# Altium project CCZynq.PrjPCB (part 3 of 4)

## Sheet Power.SchDoc
size 431 x 279 mm
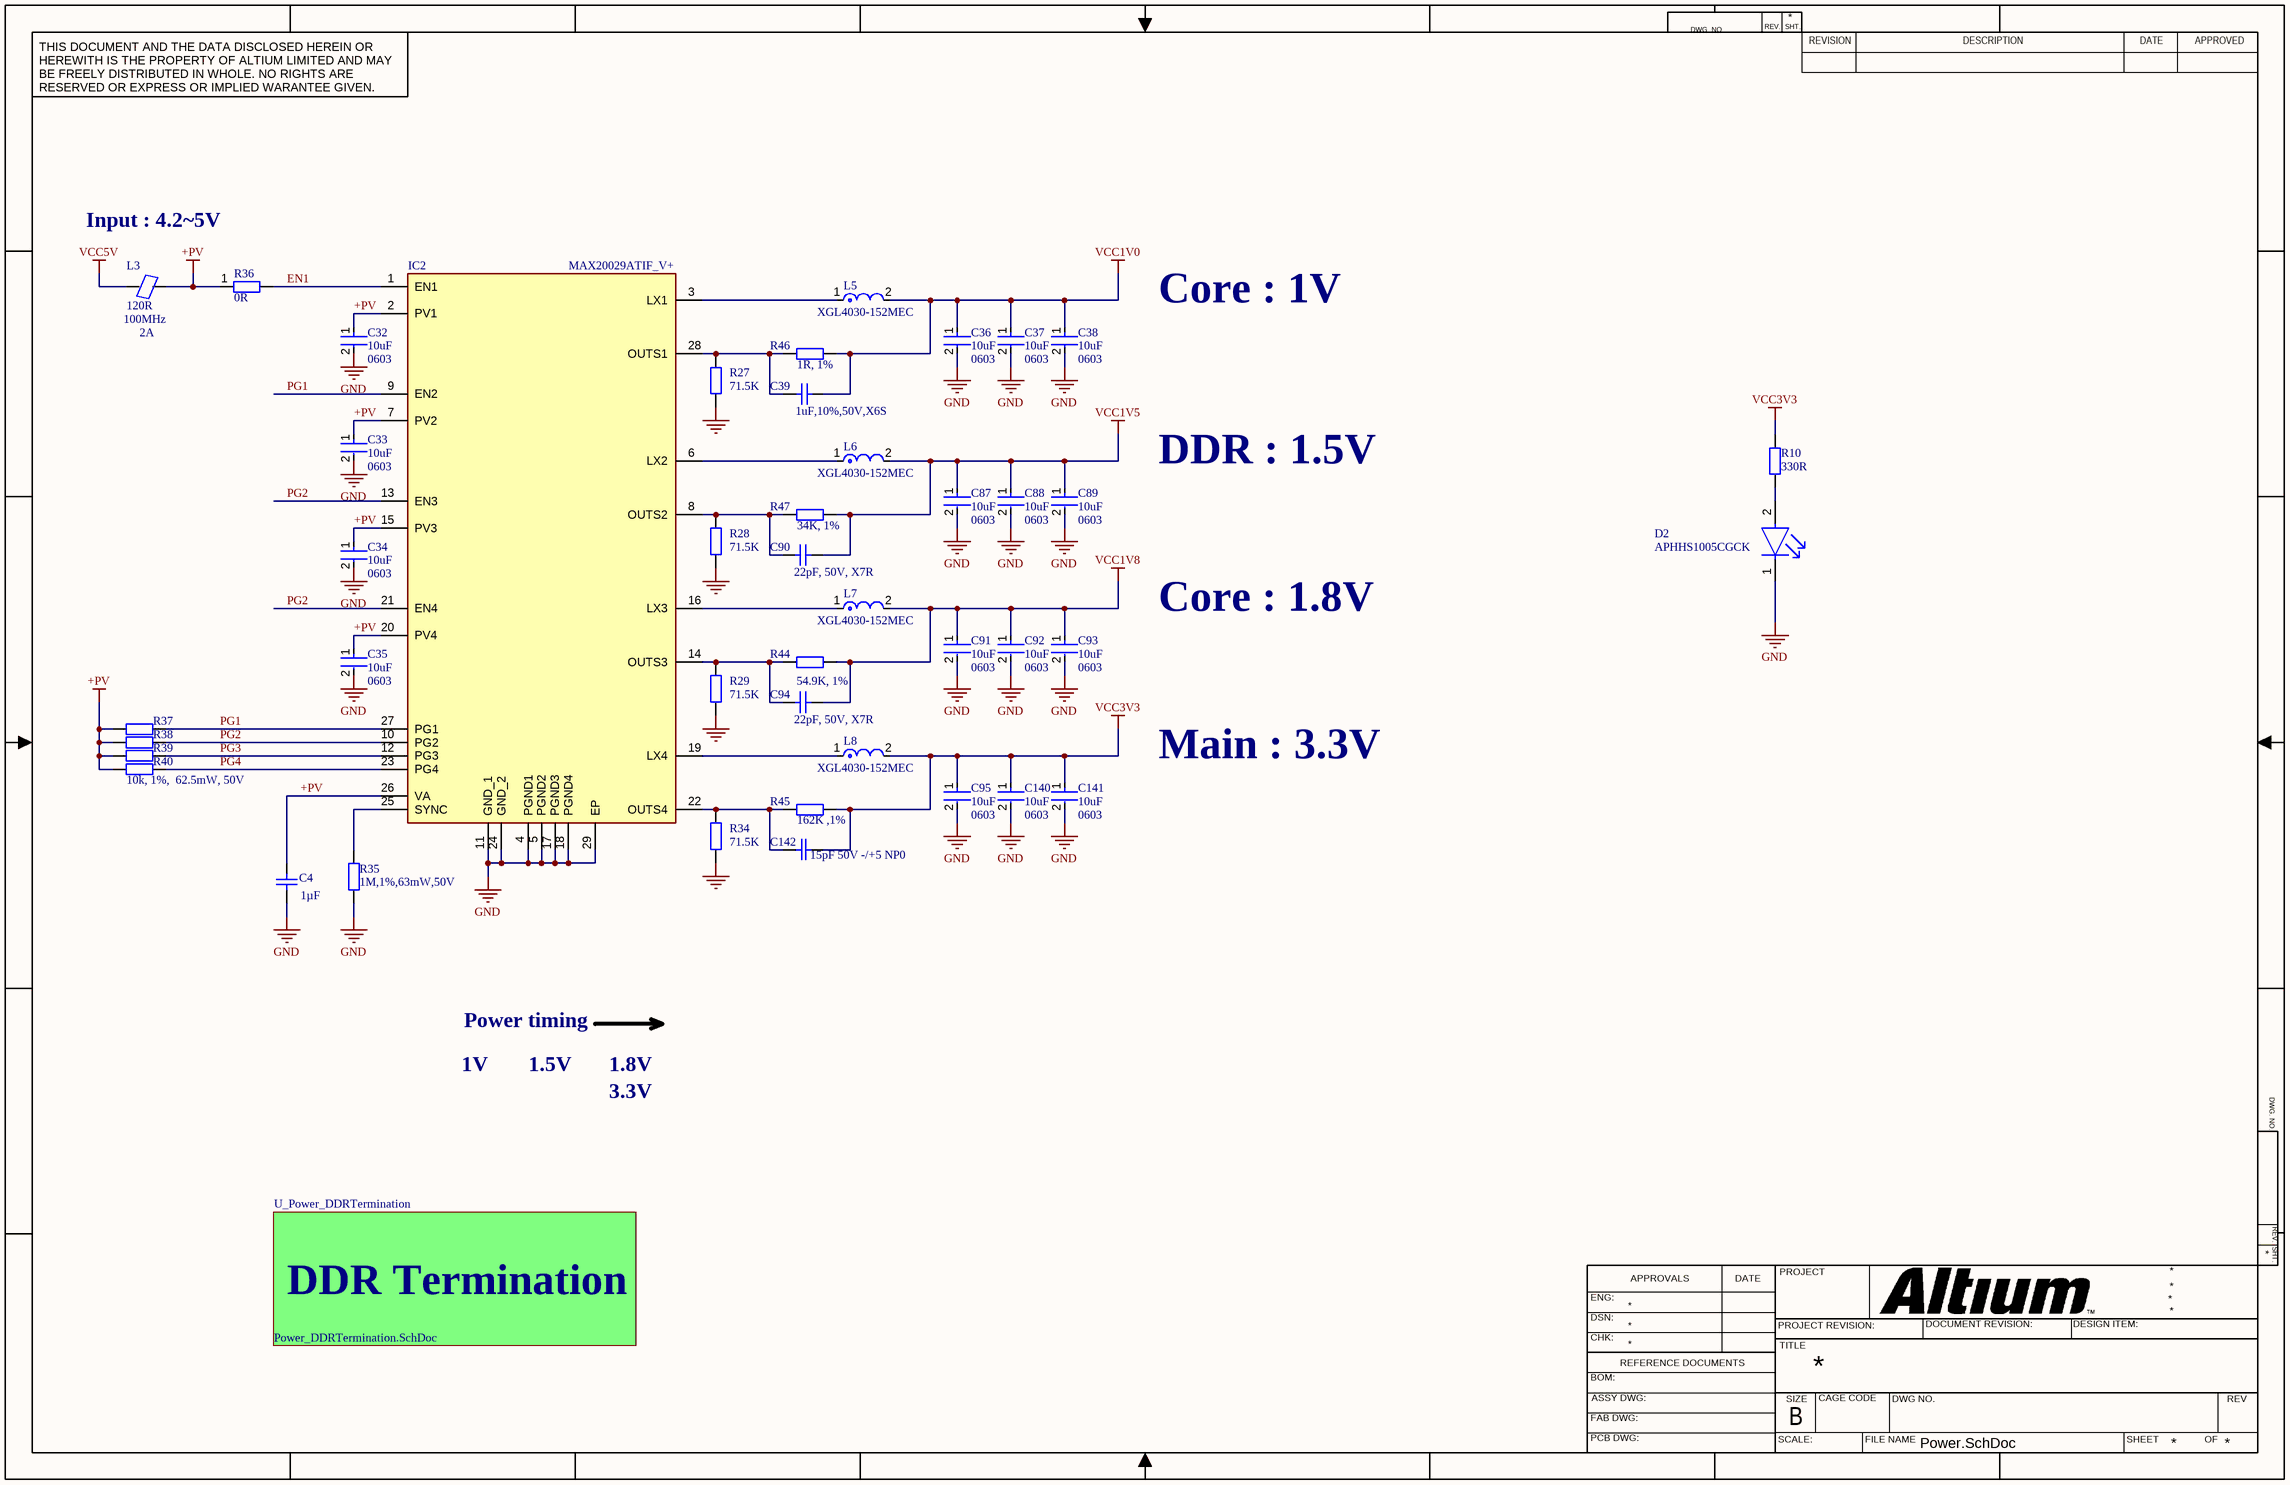
[diagram p6: Power.SchDoc]

### Parts
C4  1µF  [CAP0402i]
C32  Capacitance: 10uF  Case/Package: 0603  [FP-GRM188-0_1-e0_2_0_55-IPC_A]  (hidden comment: GRM188R60J106ME47D)
C33  Capacitance: 10uF  Case/Package: 0603  [FP-GRM188-0_1-e0_2_0_55-IPC_A]  (hidden comment: GRM188R60J106ME47D)
C34  Capacitance: 10uF  Case/Package: 0603  [FP-GRM188-0_1-e0_2_0_55-IPC_A]  (hidden comment: GRM188R60J106ME47D)
C35  Capacitance: 10uF  Case/Package: 0603  [FP-GRM188-0_1-e0_2_0_55-IPC_A]  (hidden comment: GRM188R60J106ME47D)
C36  Capacitance: 10uF  Case/Package: 0603  [FP-GRM188-0_1-e0_2_0_55-IPC_A]  (hidden comment: GRM188R60J106ME47D)
C37  Capacitance: 10uF  Case/Package: 0603  [FP-GRM188-0_1-e0_2_0_55-IPC_A]  (hidden comment: GRM188R60J106ME47D)
C38  Capacitance: 10uF  Case/Package: 0603  [FP-GRM188-0_1-e0_2_0_55-IPC_A]  (hidden comment: GRM188R60J106ME47D)
C39  value 1uF,10%,50V,X6S  [CAP0402i]  (hidden comment: 1µF)
C87  Capacitance: 10uF  Case/Package: 0603  [FP-GRM188-0_1-e0_2_0_55-IPC_A]  (hidden comment: GRM188R60J106ME47D)
C88  Capacitance: 10uF  Case/Package: 0603  [FP-GRM188-0_1-e0_2_0_55-IPC_A]  (hidden comment: GRM188R60J106ME47D)
C89  Capacitance: 10uF  Case/Package: 0603  [FP-GRM188-0_1-e0_2_0_55-IPC_A]  (hidden comment: GRM188R60J106ME47D)
C90  value 22pF, 50V, X7R  [cap0402i]  (hidden comment: 22pF)
C91  Capacitance: 10uF  Case/Package: 0603  [FP-GRM188-0_1-e0_2_0_55-IPC_A]  (hidden comment: GRM188R60J106ME47D)
C92  Capacitance: 10uF  Case/Package: 0603  [FP-GRM188-0_1-e0_2_0_55-IPC_A]  (hidden comment: GRM188R60J106ME47D)
C93  Capacitance: 10uF  Case/Package: 0603  [FP-GRM188-0_1-e0_2_0_55-IPC_A]  (hidden comment: GRM188R60J106ME47D)
C94  value 22pF, 50V, X7R  [cap0402i]  (hidden comment: 22pF)
C95  Capacitance: 10uF  Case/Package: 0603  [FP-GRM188-0_1-e0_2_0_55-IPC_A]  (hidden comment: GRM188R60J106ME47D)
C140  Capacitance: 10uF  Case/Package: 0603  [FP-GRM188-0_1-e0_2_0_55-IPC_A]  (hidden comment: GRM188R60J106ME47D)
C141  Capacitance: 10uF  Case/Package: 0603  [FP-GRM188-0_1-e0_2_0_55-IPC_A]  (hidden comment: GRM188R60J106ME47D)
C142  value 15pF 50V -/+5 NP0  [CAP0402i]  (hidden comment: 15pF)
D2  APHHS1005CGCK  [FP-APHHS1005CGCK-MFG]
IC2  MAX20029ATIF_V+  [QFN50P500X500X80-29N]
L3  Impedance: 120R  Max DC Current: 2A  Test Frequency: 100MHz  [CAP0402i]  (hidden comment: FB_120@100MHz)
L5  XGL4030-152MEC  [FP-XGL4030-MFG]
L6  XGL4030-152MEC  [FP-XGL4030-MFG]
L7  XGL4030-152MEC  [FP-XGL4030-MFG]
L8  XGL4030-152MEC  [FP-XGL4030-MFG]
R10  330R  [RES0402i]
R27  71.5K  [RES0402i]
R28  71.5K  [RES0402i]
R29  71.5K  [RES0402i]
R34  71.5K  [RES0402i]
R35  value 1M,1%,63mW,50V  [RES0402i]  (hidden comment: 1MOhm)
R36  value 0R  [RES0402i]  (hidden comment: 0 Ohms)
R37  10 kOhms  [RES0402i]  (value not drawn)
R38  10 kOhms  [RES0402i]  (value not drawn)
R39  10 kOhms  [RES0402i]  (value not drawn)
R40  value 10k, 1%,  62.5mW, 50V  [RES0402i]  (hidden comment: 10 kOhms)
R44  value 54.9K, 1%  [RES0402i]  (hidden comment: 54.9K)
R45  value 162K ,1%  [RES0402i]  (hidden comment: 162K)
R46  value 1R, 1%  [RES0402i]  (hidden comment: 1R)
R47  value 34K, 1%  [RES0402i]  (hidden comment: 34K)

### Sub-sheets
U_Power_DDRTermination = Power_DDRTermination.SchDoc: no entries

### Nets
+PV: C4.2 C32.1 C33.1 C34.1 C35.1 IC2.2(PV1) IC2.7(PV2) IC2.15(PV3) IC2.20(PV4) IC2.26(VA) L3.2 R36.1 R37.1 R38.1 R39.1 R40.1
GND: C4.1 C32.2 C33.2 C34.2 C35.2 C36.2 C37.2 C38.2 C87.2 C88.2 C89.2 C91.2 C92.2 C93.2 C95.2 C140.2 C141.2 D2.1(C) IC2.4(PGND1) IC2.5(PGND2) IC2.11(GND_1) IC2.17(PGND3) IC2.18(PGND4) IC2.24(GND_2) IC2.29(EP) R27.1 R28.1 R29.1 R34.1 R35.1
VCC1V0: C36.1 C37.1 C38.1 C39.2 L5.2 R46.2
VCC1V5: C87.1 C88.1 C89.1 C90.2 L6.2 R47.2
VCC1V8: C91.1 C92.1 C93.1 C94.2 L7.2 R44.2
VCC3V3: C95.1 C140.1 C141.1 C142.1 L8.2 R10.2 R45.2
VCC5V: L3.1
EN1: IC2.1(EN1) R36.2
PG1: IC2.9(EN2) IC2.27(PG1) R37.2
PG2: IC2.10(PG2) IC2.13(EN3) IC2.21(EN4) R38.2
PG3: IC2.12(PG3) R39.2
PG4: IC2.23(PG4) R40.2
NetC39_1: C39.1 IC2.28(OUTS1) R27.2 R46.1
NetC90_1: C90.1 IC2.8(OUTS2) R28.2 R47.1
NetC94_1: C94.1 IC2.14(OUTS3) R29.2 R44.1
NetC142_2: C142.2 IC2.22(OUTS4) R34.2 R45.1
NetD2_2: D2.2(A) R10.1
NetIC2_3: IC2.3(LX1) L5.1
NetIC2_6: IC2.6(LX2) L6.1
NetIC2_16: IC2.16(LX3) L7.1
NetIC2_19: IC2.19(LX4) L8.1
NetIC2_25: IC2.25(SYNC) R35.2

### Notes on the sheet
- Input : 4.2~5V
- Core : 1V
- DDR : 1.5V
- Core : 1.8V
- Main : 3.3V
- Power timing
- 1V
- 1.5V
- 1.8V
- 3.3V
- DDR Termination
- DWG. NO.
- REV.
- SHT.
- THIS DOCUMENT AND THE DATA DISCLOSED HEREIN OR HEREWITH IS THE PROPERTY OF ALTIUM LIMITED AND MAY BE FREELY DISTRIBUTED IN WHOLE. NO RIGHTS ARE RESERVED OR EXPRESS OR IMPLIED WARANTEE GIVEN.
- REVISION
- DESCRIPTION
- DATE
- APPROVED
- ENG:
- APPROVALS
- PROJECT
- DSN:
- CHK:
- REFERENCE DOCUMENTS
- PROJECT REVISION:
- TITLE
- DOCUMENT REVISION:
- DESIGN ITEM:
- BOM:
- FAB DWG:
- PCB DWG:
- ASSY DWG:
- SCALE:
- SIZE
- B
- CAGE CODE
- FILE NAME
- DWG NO.
- SHEET
- OF
- REV

### Library data of the parts
C4 C39 = Cap_1uF_50V_X6S_0402: 0402, 1uF,  10%, 50V, X6S; Part Number: GRT155C81E105KE13D; Manufacturer: Murata; Voltage: 25V; Type: Ceramic; Temperature Coefficient: X6S; Tolerance: ±10%; Operating Temperature: -55°C ~ 105°C; Mounting Type: SMT; Package: 0402 (1005 Metric); Applications: Automotive; Ratings: AEC-Q200; Supplier 1: Mouser; Supplier Part Number 1: 81-GRT155C81E105KE3D; Manufacturer Part Number: GRT155C81E105KE13D; Component Type: Generic; Capacitance: 1µF; Note: *; Supplier 2: DigiKey; Supplier 3: Farnell; Supplier Part Number 2: 490-18215-1-ND; Supplier Part Number 3: 2672107
  C4: Value: 1uF,10%,50V,X6S
C32-C38 C87-C89 C91-C93 C95 C140 C141 = CMP-2006-02792-2: Chip Multilayer Ceramic Capacitors for General Purpose, 0603, 10uF, X5R, 15%, 20%, 6.3V; Packaging: Tape and Reel; Voltage Rating (DC): 6.3V; Width: 0.031inch; Termination: SMD/SMT; Dielectric: X5R; Package Quantity: 4000; Voltage Rating: 6.3V; Min Operating Temperature: -55°C; Voltage: 6.3V; Length: 1.6mm; Thickness: 0.035inch; Lead Free: Lead Free; Depth: 0.8mm; Case Code (Imperial): 0603; Max Operating Temperature: 85°C; Material: Ceramic; Height: 0.8mm; Tolerance: 20%; Mount: Surface Mount; REACH SVHC: No SVHC; Radiation Hardening: No; Case Code (Metric): 1608
C90 C94 = CAP_22pF_50V_X7R_0402: Multilayer Ceramic Capacitor, AEC-Q200 CGA Series, 22 pF, - 5%, C0G / NP0, 50 V; Manufacturer 1: TDK; Manufacturer Part Number 1: CGA2B2C0G1H220J050BA; Voltage Rating: 50V; Capacitance: 22pF; Supplier 1: Digi-Key; RoHS: Yes; Category: Ceramic Capacitors; Stock 1: 105879; Pricing 1: 1=0.10000, 10=0.05200, 50=0.02840, 100=0.02320, 500=0.01654, 1000=0.01299, 2500=0.01181, 5000=0.01087 (USD); Mount: Surface Mount; Case/Package: 0402; Case Code (Metric): 1005; Case Code (Imperial): 0402; Weight: 2.3E-05oz; Min Operating Temperature: -55°C; Max Operating Temperature: 125°C; Tolerance: 5%; Package Quantity: 10000; Packaging: Tape and Reel; Dielectric: C0G; Voltage Rating (DC): 50V; Series: CGA; Termination: SMD/SMT; Resistor Type: Ceramic; Length: 1mm; Width: 0.02inch; Height: 0.5mm; Depth: 0.5mm; Thickness: 0.022inch; Ratings: AEC-Q200; RoHS Compliant: Yes; Lead Free: Lead Free; REACH SVHC: No SVHC; ComponentLink1URL: https://datasheet.ciiva.com/24219/cga2b2c0g1h220j050ba-265690-24219866.pdf?src-supplier=Mouser; ComponentLink1Description: https://datasheet.ciiva.com/24219/cga2b2c0g1h220j050ba-265690-24219866.pdf?src-supplier=Mouser; ComponentLink2URL: https://datasheet.ciiva.com/23803/1936565-23803065.pdf?src-supplier=Newark; ComponentLink2Description: https://datasheet.ciiva.com/23803/1936565-23803065.pdf?src-supplier=Newark; ComponentLink3URL: https://datasheet.ciiva.com/28563/1735392-28563914.pdf?src-supplier=Element14; ComponentLink3Description: https://datasheet.ciiva.com/28563/1735392-28563914.pdf?src-supplier=Element14; Supplier 2: Mouser; Stock 2: 202942; Pricing 2: 1=0.12000, 10=0.05600, 50=0.05600, 100=0.02500, 1000=0.01400, 10000=0.01100 (USD); Supplier 3: Farnell; Stock 3: 17918; Pricing 3: 10=0.04830, 100=0.02130, 500=0.01230, 2500=0.01120, 5000=0.01010 (GBP); Supplier Part Number 1: 445-5588-1-ND; Supplier Part Number 2: 810-CGA2B2C0G1H220J; Supplier Part Number 3: 2210771; Part Number: CGA2B2C0G1H220J050BA; Component Type: Generic
C142 = Cap_15pF_50V_0402: 0402 15 pF 50 V ±5 % Tolerance NP0 SMT Multilayer Ceramic Capacitor; Manufacturer: Yageo; Manufacturer Part Number: CC0402JRNPO9BN150; Voltage Rating (DC): 50V; Tolerance: 5%; Dielectric: C0G; Insulation Resistance: 100GR; Lead Free: Lead Free; Max Operating Temperature: 125°C; Width: 0.02inch; Voltage: 50V; Min Operating Temperature: -55°C; Termination: SMD/SMT; RoHS Compliant: Yes; Capacitance: 15pF; Case Code (Imperial): 0402; Case/Package: 0402; Case Code (Metric): 1005; Series: CC; Length: 1mm; Height: 0.5mm; Package Quantity: 1; Voltage Rating: 50V; Depth: 0.5mm; Radiation Hardening: No; Thickness: 0.022inch; Packaging: Tape and Reel; Supplier 1: Mouser; Supplier Part Number 1: 603-CC402JRNPO9BN150; RoHS: Yes; Category: Ceramic Capacitors; Stock 1: 256699; Pricing 1: 1=0.10000, 10=0.01300, 50=0.01300, 100=0.01100, 1000=0.00600, 10000=0.00400 (USD); Mounting Technology: Surface Mount; Pins: 2; Reach SVHC Compliant: Yes; ComponentLink1URL: https://datasheet.ciiva.com/5789/1443161-5789504.pdf?src-supplier=Farnell; ComponentLink1Description: https://datasheet.ciiva.com/5789/1443161-5789504.pdf?src-supplier=Farnell; ComponentLink2URL: https://datasheet.ciiva.com/26862/getdatasheetpartid-403449-26862595.pdf?src-supplier=Verical; ComponentLink2Description: https://datasheet.ciiva.com/26862/getdatasheetpartid-403449-26862595.pdf?src-supplier=Verical; ComponentLink3URL: https://datasheet.ciiva.com/144/mlccorderingcode-144002.pdf?src-supplier=Digi-Key; ComponentLink3Description: https://datasheet.ciiva.com/144/mlccorderingcode-144002.pdf?src-supplier=Digi-Key; ComponentLink4URL: https://datasheet.ciiva.com/144/mlccorderingcode-144001.pdf?src-supplier=Digi-Key; ComponentLink4Description: https://datasheet.ciiva.com/144/mlccorderingcode-144001.pdf?src-supplier=Digi-Key; ComponentLink5URL: https://datasheet.ciiva.com/144/mlccorderingcode-144003.pdf?src-supplier=Digi-Key; ComponentLink5Description: https://datasheet.ciiva.com/144/mlccorderingcode-144003.pdf?src-supplier=Digi-Key; ComponentLink6URL: https://datasheet.ciiva.com/13386/upy-gp-np0-16v-to-50v-8-13386330.pdf?src-supplier=Mouser; ComponentLink6Description: https://datasheet.ciiva.com/13386/upy-gp-np0-16v-to-50v-8-13386330.pdf?src-supplier=Mouser; ComponentLink7URL: https://datasheet.ciiva.com/11587/upy-gp-np0-16v-to-50v-8-11587085.pdf?src-supplier=Avnet; ComponentLink7Description: https://datasheet.ciiva.com/11587/upy-gp-np0-16v-to-50v-8-11587085.pdf?src-supplier=Avnet; Part Number: CC0402JRNPO9BN150; Manufacturer 1: Yageo; Component Type: Generic; Note: *; Manufacturer Part Number 1: CC0402JRNPO9BN150; Dielectric Material: Ceramic; Resistor Type: Ceramic; Supplier 2: Digi-Key; Stock 2: 1634123; Pricing 2: 1=0.10000, 10=0.02400, 50=0.01300, 100=0.01070, 500=0.00764, 1000=0.00600, 2500=0.00546, 5000=0.00502 (USD); Supplier 3: Farnell; Stock 3: 1588454; Pricing 3: 10=0.01300, 100=0.01100, 500=0.00600, 2500=0.00550, 5000=0.00500, 10000=0.00400, 50000=0.00390 (EUR); Supplier Part Number 2: 311-1017-1-ND; Supplier Part Number 3: 3019172
D2 = CMP-44529-000044-1: LED GREEN CLEAR CHIP SMD; Viewing Angle: 120°; Dominant Wavelength: 570nm; Test Current: 20mA; Luminous Intensity: 50mcd; Forward Voltage: 2.1V; Number of LEDs: 1; Lens Color: Clear; Packaging: Tape and Reel; Max Operating Temperature: 85°C; Illumination Color: Green; Length: 1mm; Mount: Surface Mount; Lens Style: Clear; Color: Green; Number of Pins: 2; Wavelength: 570nm; Case/Package: 0402; Width: 0.5mm; Package Quantity: 2000; Case Code (Metric): 1005; Height: 0.6mm; Lead Free: Lead Free; Case Code (Imperial): 0402; Forward Current: 20mA; Min Operating Temperature: -40°C
IC2 = MAX20029ATIF_V+: DC to DC Converter Quad Step-Down 3V to 5.5V Automotive 28-Pin TQFN Tube; Manufacturer_Name: Analog Devices; Manufacturer_Part_Number: MAX20029ATIF/V+; Manufacturer: Maxim; Datasheet Link: https://datasheets.maximintegrated.com/en/ds/MAX20029-MAX20029D.pdf; Height: 0.8mm; Mouser Part Number: 700-MAX20029ATIF/V+; Mouser Price/Stock: https://www.mouser.co.uk/ProductDetail/Maxim-Integrated/MAX20029ATIF-V%2b?qs=uwxL4vQweFOl5TBKmLtmFg%3D%3D; Arrow Part Number: MAX20029ATIF/V+; Arrow Price/Stock: https://www.arrow.com/en/products/max20029atifv/maxim-integrated?region=nac; Supplier 1: Digi-Key; Supplier Part Number 1: 175-MAX20029ATIF/V+-ND; Manufacturer Part Number: MAX20029ATIF/V+; RoHS: Yes; Category: Voltage Regulators - Switching; Pricing 1: 1=3.98, 10=3.57, 25=3.3752, 100=2.925, 250=2.775, 500=2.49, 1000=2.25 (USD)
L3 = Ferrite Bead_ 0402_120R_100MHz_2A: Ferrite Beads Multi-Layer 120Ohm 25% 100MHz 2A 0.055Ohm DCR 0402 T/R; Manufacturer 1: Murata; Manufacturer Part Number 1: BLM15PX121SN1D; Material: Steel; Number of Lines: 1; DC Resistance (DCR): 55mR; Value: Ferrite Beads 120Ohm 100MHz 2A  0402; RoHS: Yes; Category: Inductors; Stock 1: 80000; Pricing 1: 10000=0.02260, 20000=0.02070, 30000=0.02030, 50000=0.02000 (USD); Case/Package: 0402; Number of Pins: 2; Case Code (Metric): 1005; Case Code (Imperial): 0402; Weight: 2.3E-05oz; Min Operating Temperature: -55°C; Max Operating Temperature: 125°C; Package Quantity: 10000; Tolerance: 25%; Packaging: Tape and Reel; Current Rating: 2A; Max Current Rating: 2A; Termination: SMD/SMT; Number of Circuits: 1; Series: EMIFIL®, BLM15P; Length: 1mm; Width: 0.5mm; Height: 0.5mm; REACH SVHC: No SVHC; Lead Free: Lead Free; RoHS Compliant: Yes; ComponentLink1URL: https://datasheet.ciiva.com/41449/001172210-da-01-en-drossel-0402-120r-1-0x0-5mm-10000st-41449498.pdf?src-supplier=Conrad; ComponentLink1Description: https://datasheet.ciiva.com/41449/001172210-da-01-en-drossel-0402-120r-1-0x0-5mm-10000st-41449498.pdf?src-supplier=Conrad; ComponentLink2URL: https://datasheet.ciiva.com/41860/l0110e-41860699.pdf?src-supplier=Digi-Key; ComponentLink2Description: https://datasheet.ciiva.com/41860/l0110e-41860699.pdf?src-supplier=Digi-Key; ComponentLink3URL: https://datasheet.ciiva.com/29364/l0110e-29364069.pdf?src-supplier=Digi-Key; ComponentLink3Description: https://datasheet.ciiva.com/29364/l0110e-29364069.pdf?src-supplier=Digi-Key; Stock 2: 723874; Pricing 2: 1=0.10000, 10=0.05600, 50=0.05600, 100=0.03800, 500=0.03200, 1000=0.02700, 2500=0.02600, 5000=0.02400, 10000=0.02300, 20000=0.02100 (USD); Stock 3: 1310967; Pricing 3: 1=0.10000, 10=0.08400, 25=0.07560, 50=0.05540, 100=0.04790, 250=0.03780, 500=0.03192, 1000=0.02688, 5000=0.02394 (USD); Part Number: BLM15PX121SN1D; Supplier 1: Mouser; Supplier 2: Digi-Key; Supplier 3: Arrow Electronics; Supplier Part Number 1: 81-BLM15PX121SN1D; Supplier Part Number 2: 490-9656-1-ND; Supplier Part Number 3: BLM15PX121SN1D; Component Type: Generic
L5-L8 = CMP-11268-000146-1: SHIELDED POWER INDUCTORS, 1.5UH
R10 = Res_330R_1%_50V_0402: Res Thick Film 0402 330 Ohm 1% 1/16W ±100ppm/°C Molded SMD Paper T/R; Part Number: CRCW0402330RFKED; Manufacturer 1: Vishay; Voltage: 50; Power Rating: 63mW; Voltage Rating: 50V; Value: 330R,1%,1/10W,50V; ComponentLink1Description: https://datasheet.ciiva.com/11821/0900766b80f80784-11821294.pdf?src-supplier=RSComponents; ComponentLink1URL: https://datasheet.ciiva.com/11821/0900766b80f80784-11821294.pdf?src-supplier=RSComponents; Manufacturer Part Number 1: CRCW0402330RFKED; Component Type: Generic; Resistance: 330R; Note: *; ComponentLink2URL: https://datasheet.ciiva.com/7802/aoa0000ce2-7802409.pdf?src-supplier=Element14; ComponentLink2Description: https://datasheet.ciiva.com/7802/aoa0000ce2-7802409.pdf?src-supplier=Element14; ComponentLink3URL: https://datasheet.ciiva.com/22673/1678782-22673685.pdf?src-supplier=Element14; ComponentLink3Description: https://datasheet.ciiva.com/22673/1678782-22673685.pdf?src-supplier=Element14; ComponentLink4URL: https://datasheet.ciiva.com/22687/1678782-22687071.pdf?src-supplier=Element14; ComponentLink4Description: https://datasheet.ciiva.com/22687/1678782-22687071.pdf?src-supplier=Element14; ComponentLink5URL: https://datasheet.ciiva.com/22737/426256-22737285.pdf?src-supplier=Element14; ComponentLink5Description: https://datasheet.ciiva.com/22737/426256-22737285.pdf?src-supplier=Element14; ComponentLink6URL: https://datasheet.ciiva.com/46420/1678782-46420317.pdf?src-supplier=Element14; ComponentLink6Description: https://datasheet.ciiva.com/46420/1678782-46420317.pdf?src-supplier=Element14; ComponentLink7URL: https://datasheet.ciiva.com/24024/aoa0000ce2-24024398.pdf?src-supplier=Mouser; ComponentLink7Description: https://datasheet.ciiva.com/24024/aoa0000ce2-24024398.pdf?src-supplier=Mouser; ComponentLink8URL: https://datasheet.ciiva.com/16784/70260748-16784773.pdf?src-supplier=Allied+Electronics; ComponentLink8Description: https://datasheet.ciiva.com/16784/70260748-16784773.pdf?src-supplier=Allied+Electronics; ComponentLink9URL: https://datasheet.ciiva.com/9190/aoa0000ce2-9190679.pdf?src-supplier=Avnet; ComponentLink9Description: https://datasheet.ciiva.com/9190/aoa0000ce2-9190679.pdf?src-supplier=Avnet; ComponentLink10URL: https://datasheet.ciiva.com/30159/aoa0000ce2-30159014.pdf?src-supplier=Onlinecomponents.com; ComponentLink10Description: https://datasheet.ciiva.com/30159/aoa0000ce2-30159014.pdf?src-supplier=Onlinecomponents.com; Supplier 1: Mouser; Manufacturer: Vishay; Manufacturer Part Number: CRCW0402330RFKED; RoHS: Yes; Category: Chip SMD Resistors; Stock 1: 25067; Pricing 1: 1=0.1, 10=0.042, 50=0.042, 100=0.017, 1000=0.008, 10000=0.005 (USD); Case/Package: 0402; Case Code (Imperial): 0402; Case Code (Metric): 1005; Contact Plating: Tin; Weight: 2.3E-05oz; Min Operating Temperature: -55°C; Max Operating Temperature: 155°C; Packaging: Tape and Reel; Temperature Coefficient: 100ppm/°C; Series: CRCW; Tolerance: 1%; Number of Terminations: 2; Max Power Dissipation: 63mW; Resistor Type: Thick Film; Features: Automotive AEC-Q200; Resistance Tolerance: 1%; Package Quantity: 10; Termination: SMD/SMT; Voltage Rating (DC): 50V; Construction: Rectangular; Technology: THICK FILM; Length: 1mm; Width: 0.02inch; Height: 0.35mm; Depth: 0.5mm; Radiation Hardening: No; RoHS Compliant: Yes; Reach SVHC Compliant: Unknown; Lead Free: Lead Free; Military Standard: Not; ComponentLink11URL: https://datasheet.ciiva.com/11811/0900766b80d98824-11811100.pdf?src-supplier=Rs; ComponentLink11Description: https://datasheet.ciiva.com/11811/0900766b80d98824-11811100.pdf?src-supplier=Rs; ComponentLink12URL: https://datasheet.ciiva.com/7777/1697337-7777541.pdf?src-supplier=Element14; ComponentLink12Description: https://datasheet.ciiva.com/7777/1697337-7777541.pdf?src-supplier=Element14; ComponentLink13URL: https://datasheet.ciiva.com/7777/1697337-7777542.pdf?src-supplier=Element14; ComponentLink13Description: https://datasheet.ciiva.com/7777/1697337-7777542.pdf?src-supplier=Element14; ComponentLink14URL: https://datasheet.ciiva.com/2463/dcrcwe3-2463479.pdf?src-supplier=Digi-Key; ComponentLink14Description: https://datasheet.ciiva.com/2463/dcrcwe3-2463479.pdf?src-supplier=Digi-Key; ComponentLink15URL: https://datasheet.ciiva.com/2463/dcrcwe3-2463480.pdf?src-supplier=Digi-Key; ComponentLink15Description: https://datasheet.ciiva.com/2463/dcrcwe3-2463480.pdf?src-supplier=Digi-Key; ComponentLink16URL: https://datasheet.ciiva.com/2463/dcrcwe3-2463478.pdf?src-supplier=Digi-Key; ComponentLink16Description: https://datasheet.ciiva.com/2463/dcrcwe3-2463478.pdf?src-supplier=Digi-Key; ComponentLink17URL: https://datasheet.ciiva.com/16772/70201119-16772762.pdf?src-supplier=Allied+Electronics; ComponentLink17Description: https://datasheet.ciiva.com/16772/70201119-16772762.pdf?src-supplier=Allied+Electronics; ComponentLink18URL: https://datasheet.ciiva.com/5549/dcrcwe3-109170-5549013.pdf?src-supplier=Mouser; ComponentLink18Description: https://datasheet.ciiva.com/5549/dcrcwe3-109170-5549013.pdf?src-supplier=Mouser; ComponentLink19URL: https://datasheet.ciiva.com/16429/dcrcwe3-16429993.pdf?src-supplier=Future+Electronics; ComponentLink19Description: https://datasheet.ciiva.com/16429/dcrcwe3-16429993.pdf?src-supplier=Future+Electronics; ComponentLink20URL: https://datasheet.ciiva.com/3256/dcrcwe3-3256405.pdf?src-supplier=Avnet; ComponentLink20Description: https://datasheet.ciiva.com/3256/dcrcwe3-3256405.pdf?src-supplier=Avnet; Supplier 2: Digi-Key; Stock 2: 134870; Pricing 2: 1=0.1, 10=0.037, 100=0.0149, 1000=0.00668, 2500=0.0058, 5000=0.00479 (USD); Supplier 3: Farnell; Stock 3: 164855; Pricing 3: 10=0.0395, 100=0.016, 500=0.0075, 2500=0.0066, 5000=0.0056, 10000=0.0047, 50000=0.0046, 100000=0.0045 (EUR); Supplier Part Number 1: 71-CRCW0402-330-E3; Supplier Part Number 2: 541-330LCT-ND; Supplier Part Number 3: 1469709
R27-R29 R34 = Res_71.5K_1%_1/10W_0402: Res Thick Film 0402 71.5K Ohm 1% 1/10W ±100ppm/°C Molded SMD Punched Carrier T/R; Part Number: ERJ-2RKF7152X; Manufacturer 1: Panasonic; Power Rating: 100mW; Voltage Rating: 50V; Value: 71.5KR,1%,1/16W,50V; Tolerance: ±1%; Operating Temperature: -55°C ~ 125°C; Mounting Type: SMT; Package: 0402 (1005 Metric); Manufacturer Part Number 1: ERJ-2RKF7152X; Component Type: Generic; Resistance: 71.5K; Note: *; Alternative Part Number: *; Manufacturer 2: *; Manufacturer Part Number 2: *; Manufacturer: Panasonic; Manufacturer Part Number: ERJ-2RKF7152X; RoHS: Yes; Category: Chip SMD Resistors; Stock 1: 80974; Pricing 1: 1=0.09340, 10=0.02090, 100=0.01040, 1000=0.00420, 2500=0.00410, 10000=0.00320, 30000=0.00290 (USD); Mount: Surface Mount; Case/Package: 0402; Case Code (Metric): 1005; Case Code (Imperial): 0402; Contact Plating: Tin; Min Operating Temperature: -55°C; Max Operating Temperature: 155°C; Packaging: Tape and Reel; Series: ERJ; Voltage Rating (DC): 50V; Resistor Type: Thick Film; Termination: SMD/SMT; Number of Terminations: 2; Max Power Dissipation: 100mW; Package Quantity: 1; Features: Automotive AEC-Q200; Construction: Rectangular; Resistance Tolerance: 1%; Length: 1mm; Width: 0.02inch; Height: 0.016inch; Depth: 0.5mm; RoHS Compliant: Yes; Lead Free: Contains Lead; Military Standard: Not; REACH SVHC: Yes; ComponentLink1URL: https://datasheet.ciiva.com/7861/aoa0000ce2-7861997.pdf?src-supplier=Element14; ComponentLink1Description: https://datasheet.ciiva.com/7861/aoa0000ce2-7861997.pdf?src-supplier=Element14; ComponentLink2URL: https://datasheet.ciiva.com/43467/1678782-43467469.pdf?src-supplier=Farnell; ComponentLink2Description: https://datasheet.ciiva.com/43467/1678782-43467469.pdf?src-supplier=Farnell; ComponentLink3URL: https://datasheet.ciiva.com/46372/1678782-46372878.pdf?src-supplier=Element14; ComponentLink3Description: https://datasheet.ciiva.com/46372/1678782-46372878.pdf?src-supplier=Element14; ComponentLink4URL: https://datasheet.ciiva.com/22668/1678782-22668152.pdf?src-supplier=Element14; ComponentLink4Description: https://datasheet.ciiva.com/22668/1678782-22668152.pdf?src-supplier=Element14; ComponentLink5URL: https://datasheet.ciiva.com/28592/1694929-28592264.pdf?src-supplier=Element14; ComponentLink5Description: https://datasheet.ciiva.com/28592/1694929-28592264.pdf?src-supplier=Element14; ComponentLink6URL: https://datasheet.ciiva.com/46372/1678782-46372877.pdf?src-supplier=Element14; ComponentLink6Description: https://datasheet.ciiva.com/46372/1678782-46372877.pdf?src-supplier=Element14; ComponentLink7URL: https://datasheet.ciiva.com/24027/aoa0000ce2-24027461.pdf?src-supplier=Mouser; ComponentLink7Description: https://datasheet.ciiva.com/24027/aoa0000ce2-24027461.pdf?src-supplier=Mouser; ComponentLink8URL: https://datasheet.ciiva.com/16786/70260748-16786679.pdf?src-supplier=Allied+Electronics; ComponentLink8Description: https://datasheet.ciiva.com/16786/70260748-16786679.pdf?src-supplier=Allied+Electronics; ComponentLink9URL: https://datasheet.ciiva.com/16766/70260748-16766095.pdf?src-supplier=Allied+Electronics; ComponentLink9Description: https://datasheet.ciiva.com/16766/70260748-16766095.pdf?src-supplier=Allied+Electronics; Stock 2: 70314; Pricing 2: 1=0.10000, 10=0.03400, 100=0.01370, 1000=0.00615, 2500=0.00534, 5000=0.00441 (USD); Stock 3: 301603; Pricing 3: 1=0.10000, 10=0.03400, 50=0.03400, 100=0.01400, 1000=0.00700, 10000=0.00500 (USD); Stock 4: 70000; Pricing 4: 10000=0.00400, 50000=0.00390 (GBP); Supplier 1: Mouser; Supplier 2: Digi-Key; Supplier 3: Farnell; Supplier Part Number 1: 667-ERJ-2RKF7152X; Supplier Part Number 2: P71.5KLCT-ND; Supplier Part Number 3: 2397370
R35 = Res_1M_1%_0402: 0402,1M,1%,63mW,50V; Part Number: ERJ-2RKF1004X; Manufacturer 1: Panasonic; Alternative Part Number: CR0402-FX-1004GLF; Temperature Coefficient: 100 PPM / C; Voltage: 50V; Tolerance: ±1%; Operating Temperature: -55°C ~ 125°C; Package: 0402 (1005 Metric); Component Type: Generic; Resistance: 1MOhm; Note: *; Manufacturer 2: Bourns; Manufacturer Part Number 2: CR0402-FX-1004GLF; Mounting Type: SMT; Manufacturer Part Number 1: ERJ-2RKF1004X; Supplier 1: Mouser; Supplier 2: Farnell; Supplier 3: Mouser; Supplier 4: Digi-Key; Supplier 5: Farnell; Supplier Part Number 1: 667-ERJ-2RKF1004X; Supplier Part Number 2: 2302957; Supplier Part Number 3: 652-CR0402FX-1004GLF; Supplier Part Number 4: CR0402-FX-1004GLFCT-ND; Supplier Part Number 5: 2908202
R36 = Res_0R_0402: 0402, 0R; Part Number: CRCW04020000Z0EDC; Manufacturer 1: Vishay; Voltage: 50V; Temperature Coefficient: 0 PPM / C; Operating Temperature: -55°C ~ 125°C; Mounting Type: SMT; Package: 0402 (1005 Metric); Applications: Commercial Grade; Supplier 1: Mouser; Supplier Part Number 1: 71-CRCW04020000Z0EDC; Manufacturer Part Number 1: CRCW04020000Z0EDC; Component Type: Generic; Resistance: 0 Ohms; Note: *; Supplier 2: DigiKey; Supplier 3: Farnell; Supplier Part Number 2: 541-4062-1-ND; Supplier Part Number 3: *
R37-R39 = Res_10k_1%_0402: 0402, 10K 1%,  62.5mW, 50V; Part Number: CR0402-FX-1002GLF; Manufacturer 1: Bourns; Temperature Coefficient: 100 PPM / C; Value: 10k, 1%,  62.5mW, 50V; Voltage: 50V; Tolerance: ±1%; Operating Temperature: -55°C ~ 125°C; Mounting Type: SMT; Package: 0402 (1005 Metric); Supplier 1: Mouser; Supplier Part Number 1: 652-CR0402FX-1002GLF; Manufacturer Part Number 1: CR0402-FX-1002GLF; Component Type: Generic; Resistance: 10 kOhms; Note: *; Supplier 2: DigiKey; Supplier 3: Farnell; Supplier Part Number 2: CR0402-FX-1002GLFCT-ND; Supplier Part Number 3: 2333566
R40 = Res_10k_1%_0402: 0402, 10K 1%,  62.5mW, 50V; Part Number: CR0402-FX-1002GLF; Manufacturer 1: Bourns; Temperature Coefficient: 100 PPM / C; Voltage: 50V; Tolerance: ±1%; Operating Temperature: -55°C ~ 125°C; Mounting Type: SMT; Package: 0402 (1005 Metric); Supplier 1: Mouser; Supplier Part Number 1: 652-CR0402FX-1002GLF; Manufacturer Part Number 1: CR0402-FX-1002GLF; Component Type: Generic; Resistance: 10 kOhms; Note: *; Supplier 2: DigiKey; Supplier 3: Farnell; Supplier Part Number 2: CR0402-FX-1002GLFCT-ND; Supplier Part Number 3: 2333566
R44 = Res_A_0402__________________________Template_1_1_1_1_1: SMD Chip Resistor, 54.9 kOhm, ± 1%, 100 mW, 0402 [1005 Metric], Thick Film, Precision; Manufacturer: Panasonic; Manufacturer Part Number: ERJ-2RKF5492X; Tolerance: ±1%; Operating Temperature: -55°C ~ 125°C; Mounting Type: SMT; Package: 0402; Component Type: Generic; Resistance: 54.9K; Note: *; Supplier Part Number 2: *; Supplier Part Number 3: *; Alternative Part Number: *; Manufacturer 2: *; Manufacturer Part Number 2: *; Supplier: Mouser; Supplier Part Number: 667-ERJ-2RKF5492X; RoHS: Yes; Category: Chip SMD Resistors; Stock: 67985; Pricing: 1=0.1, 10=0.017, 50=0.017, 100=0.008, 1000=0.006, 10000=0.003 (USD); ComponentLink1URL: https://datasheet.ciiva.com/24023/aoa0000ce2-24023851.pdf?src-supplier=Mouser; ComponentLink1Description: https://datasheet.ciiva.com/24023/aoa0000ce2-24023851.pdf?src-supplier=Mouser; ComponentLink2URL: https://datasheet.ciiva.com/9188/aoa0000ce2-9188743.pdf?src-supplier=Avnet; ComponentLink2Description: https://datasheet.ciiva.com/9188/aoa0000ce2-9188743.pdf?src-supplier=Avnet; ComponentLink3URL: https://datasheet.ciiva.com/9188/aoa0000ce2-9188745.pdf?src-supplier=Avnet; ComponentLink3Description: https://datasheet.ciiva.com/9188/aoa0000ce2-9188745.pdf?src-supplier=Avnet; ComponentLink4URL: https://datasheet.ciiva.com/46420/1678782-46420255.pdf?src-supplier=Element14; ComponentLink4Description: https://datasheet.ciiva.com/46420/1678782-46420255.pdf?src-supplier=Element14; ComponentLink5URL: https://datasheet.ciiva.com/7937/aoa0000ce2-7937433.pdf?src-supplier=Element14; ComponentLink5Description: https://datasheet.ciiva.com/7937/aoa0000ce2-7937433.pdf?src-supplier=Element14; ComponentLink6URL: https://datasheet.ciiva.com/16766/70260748-16766094.pdf?src-supplier=Allied+Electronics; ComponentLink6Description: https://datasheet.ciiva.com/16766/70260748-16766094.pdf?src-supplier=Allied+Electronics; ComponentLink7URL: https://datasheet.ciiva.com/16789/70260748-16789053.pdf?src-supplier=Allied+Electronics; ComponentLink7Description: https://datasheet.ciiva.com/16789/70260748-16789053.pdf?src-supplier=Allied+Electronics; ComponentLink8URL: https://datasheet.ciiva.com/30146/aoa0000ce2-30146855.pdf?src-supplier=Onlinecomponents.com; ComponentLink8Description: https://datasheet.ciiva.com/30146/aoa0000ce2-30146855.pdf?src-supplier=Onlinecomponents.com; Supplier 1: Mouser; Supplier Part Number 1: 667-ERJ-2RKF5492X
R45 = Res_A_0402__________________________Template_1_1_1_1_1: Res Thick Film 0402 162K Ohm 1% 0.1W ±100ppm/°C Molded SMD Punched Carrier T/R; Manufacturer: Panasonic; Manufacturer Part Number: ERJ-2RKF1623X; Tolerance: ±1%; Operating Temperature: -55°C ~ 125°C; Mounting Type: SMT; Package: 0402; Component Type: Generic; Resistance: 162K; Note: *; Supplier Part Number 2: *; Supplier Part Number 3: *; Alternative Part Number: *; Manufacturer 2: *; Manufacturer Part Number 2: *; Supplier: Mouser; Supplier Part Number: 667-ERJ-2RKF1623X; RoHS: Yes; Category: Chip SMD Resistors; Stock: 107010; Pricing: 1=0.1, 10=0.017, 50=0.017, 100=0.008, 1000=0.006, 10000=0.003 (USD); ComponentLink1URL: https://datasheet.ciiva.com/22673/1678782-22673333.pdf?src-supplier=Element14; ComponentLink1Description: https://datasheet.ciiva.com/22673/1678782-22673333.pdf?src-supplier=Element14; ComponentLink2URL: https://datasheet.ciiva.com/16766/70260748-16766970.pdf?src-supplier=Allied+Electronics; ComponentLink2Description: https://datasheet.ciiva.com/16766/70260748-16766970.pdf?src-supplier=Allied+Electronics; ComponentLink3URL: https://datasheet.ciiva.com/28531/1694929-28531487.pdf?src-supplier=Element14; ComponentLink3Description: https://datasheet.ciiva.com/28531/1694929-28531487.pdf?src-supplier=Element14; ComponentLink4URL: https://datasheet.ciiva.com/46373/1678782-46373150.pdf?src-supplier=Element14; ComponentLink4Description: https://datasheet.ciiva.com/46373/1678782-46373150.pdf?src-supplier=Element14; ComponentLink5URL: https://datasheet.ciiva.com/46373/1678782-46373151.pdf?src-supplier=Element14; ComponentLink5Description: https://datasheet.ciiva.com/46373/1678782-46373151.pdf?src-supplier=Element14; ComponentLink6URL: https://datasheet.ciiva.com/7861/1678782-7861989.pdf?src-supplier=Element14; ComponentLink6Description: https://datasheet.ciiva.com/7861/1678782-7861989.pdf?src-supplier=Element14; ComponentLink7URL: https://datasheet.ciiva.com/22721/1678782-22721942.pdf?src-supplier=Farnell; ComponentLink7Description: https://datasheet.ciiva.com/22721/1678782-22721942.pdf?src-supplier=Farnell; ComponentLink8URL: https://datasheet.ciiva.com/43467/1678782-43467499.pdf?src-supplier=Farnell; ComponentLink8Description: https://datasheet.ciiva.com/43467/1678782-43467499.pdf?src-supplier=Farnell; ComponentLink9URL: https://datasheet.ciiva.com/16763/70260748-16763709.pdf?src-supplier=Allied+Electronics; ComponentLink9Description: https://datasheet.ciiva.com/16763/70260748-16763709.pdf?src-supplier=Allied+Electronics; Supplier 1: Mouser; Supplier Part Number 1: 667-ERJ-2RKF1623X
R46 = Res_A_0402__________________________Template_1_1_1_1_1: SMD Chip Resistor, 1 Ohm, ± 5%, 63 mW, 0402 [1005 Metric], Thick Film, General Purpose; Manufacturer: Vishay Dale; Manufacturer Part Number: CRCW04021R00JNED; Tolerance: ±1%; Operating Temperature: -55°C ~ 125°C; Mounting Type: SMT; Package: 0402; Component Type: Generic; Resistance: 1R; Note: *; Supplier Part Number 2: *; Supplier Part Number 3: *; Alternative Part Number: *; Manufacturer 2: *; Manufacturer Part Number 2: *; Supplier 1: Mouser; Supplier Part Number 1: 71-CRCW0402J-1.0-E3; Supplier: Mouser; Supplier Part Number: 71-CRCW0402J-1.0-E3; RoHS: Yes; Category: Chip SMD Resistors; Stock: 27024; Pricing: 1=0.1, 10=0.017, 50=0.017, 100=0.008, 1000=0.006, 10000=0.004 (USD); ComponentLink1URL: https://datasheet.ciiva.com/7743/dcrcwe3-7743510.pdf?src-supplier=Element14; ComponentLink1Description: https://datasheet.ciiva.com/7743/dcrcwe3-7743510.pdf?src-supplier=Element14; ComponentLink2URL: https://datasheet.ciiva.com/3256/dcrcwe3-3256201.pdf?src-supplier=Avnet; ComponentLink2Description: https://datasheet.ciiva.com/3256/dcrcwe3-3256201.pdf?src-supplier=Avnet; ComponentLink3URL: https://datasheet.ciiva.com/3256/dcrcwe3-3256202.pdf?src-supplier=Avnet; ComponentLink3Description: https://datasheet.ciiva.com/3256/dcrcwe3-3256202.pdf?src-supplier=Avnet; ComponentLink4URL: https://datasheet.ciiva.com/16436/dcrcwe3-16436175.pdf?src-supplier=Future+Electronics; ComponentLink4Description: https://datasheet.ciiva.com/16436/dcrcwe3-16436175.pdf?src-supplier=Future+Electronics; ComponentLink5URL: https://datasheet.ciiva.com/2462/dcrcwe3-2462067.pdf?src-supplier=Digikey; ComponentLink5Description: https://datasheet.ciiva.com/2462/dcrcwe3-2462067.pdf?src-supplier=Digikey; ComponentLink6URL: https://datasheet.ciiva.com/2462/dcrcwe3-2462068.pdf?src-supplier=Digikey; ComponentLink6Description: https://datasheet.ciiva.com/2462/dcrcwe3-2462068.pdf?src-supplier=Digikey; ComponentLink7URL: https://datasheet.ciiva.com/2462/dcrcwe3-2462069.pdf?src-supplier=Digikey; ComponentLink7Description: https://datasheet.ciiva.com/2462/dcrcwe3-2462069.pdf?src-supplier=Digikey
R47 = Res_A_0402__________________________Template_1_1_1_1_1: SMD Chip Resistor, 34 kOhm, ± 1%, 63 mW, 0402 [1005 Metric], Thick Film, General Purpose; Manufacturer: Vishay; Manufacturer Part Number: CRCW040234K0FKED; Max Power Dissipation: 63mW; Voltage Rating: 50V; Tolerance: ±1%; Operating Temperature: -55°C ~ 125°C; Mounting Type: SMT; Package: 0402; Component Type: Generic; Resistance: 34K; Note: *; Supplier Part Number 2: *; Supplier Part Number 3: *; Alternative Part Number: *; Manufacturer 2: *; Manufacturer Part Number 2: *; Supplier: Mouser; Supplier Part Number: 71-CRCW0402-34K-E3; RoHS: Yes; Category: Chip SMD Resistors; Stock: 59595; Pricing: 1=0.1, 10=0.019, 50=0.019, 100=0.009, 1000=0.006, 10000=0.004 (USD); Case/Package: 0402; Weight: 2.3E-05oz; Case Code (Metric): 1005; Case Code (Imperial): 0402; Contact Plating: Tin; Min Operating Temperature: -55°C; Max Operating Temperature: 155°C; Package Quantity: 10000; Packaging: Tape and Reel; Number of Terminations: 2; Features: Automotive AEC-Q200; Series: CRCW; Power Rating: 63mW; Resistor Type: Thick Film; Termination: SMD/SMT; Technology: THICK FILM; Resistance Tolerance: 1%; Voltage Rating (DC): 50V; Length: 1mm; Width: 0.5mm; Height: 0.35mm; Depth: 0.5mm; Radiation Hardening: No; RoHS Compliant: Yes; Lead Free: 5697LeadFree; Reach SVHC Compliant: Unknown; ComponentLink1URL: https://datasheet.ciiva.com/7743/125364-7743605.pdf?src-supplier=Element14; ComponentLink1Description: https://datasheet.ciiva.com/7743/125364-7743605.pdf?src-supplier=Element14; ComponentLink2URL: https://datasheet.ciiva.com/7671/1697337-7671583.pdf?src-supplier=Element14; ComponentLink2Description: https://datasheet.ciiva.com/7671/1697337-7671583.pdf?src-supplier=Element14; ComponentLink3URL: https://datasheet.ciiva.com/7671/1697337-7671582.pdf?src-supplier=Element14; ComponentLink3Description: https://datasheet.ciiva.com/7671/1697337-7671582.pdf?src-supplier=Element14; ComponentLink4URL: https://datasheet.ciiva.com/22705/1697337-22705819.pdf?src-supplier=Element14; ComponentLink4Description: https://datasheet.ciiva.com/22705/1697337-22705819.pdf?src-supplier=Element14; ComponentLink5URL: https://datasheet.ciiva.com/2463/dcrcwe3-2463776.pdf?src-supplier=Digikey; ComponentLink5Description: https://datasheet.ciiva.com/2463/dcrcwe3-2463776.pdf?src-supplier=Digikey; ComponentLink6URL: https://datasheet.ciiva.com/2463/dcrcwe3-2463777.pdf?src-supplier=Digikey; ComponentLink6Description: https://datasheet.ciiva.com/2463/dcrcwe3-2463777.pdf?src-supplier=Digikey; ComponentLink7URL: https://datasheet.ciiva.com/2463/dcrcwe3-2463775.pdf?src-supplier=Digikey; ComponentLink7Description: https://datasheet.ciiva.com/2463/dcrcwe3-2463775.pdf?src-supplier=Digikey; ComponentLink8URL: https://datasheet.ciiva.com/16759/70201119-16759964.pdf?src-supplier=Allied+Electronics; ComponentLink8Description: https://datasheet.ciiva.com/16759/70201119-16759964.pdf?src-supplier=Allied+Electronics; ComponentLink9URL: https://datasheet.ciiva.com/5545/dcrcwe3-109170-5545798.pdf?src-supplier=Mouser; ComponentLink9Description: https://datasheet.ciiva.com/5545/dcrcwe3-109170-5545798.pdf?src-supplier=Mouser; ComponentLink10URL: https://datasheet.ciiva.com/3256/dcrcwe3-3256427.pdf?src-supplier=Avnet; ComponentLink10Description: https://datasheet.ciiva.com/3256/dcrcwe3-3256427.pdf?src-supplier=Avnet; ComponentLink11URL: https://datasheet.ciiva.com/3256/dcrcwe3-3256428.pdf?src-supplier=Avnet; ComponentLink11Description: https://datasheet.ciiva.com/3256/dcrcwe3-3256428.pdf?src-supplier=Avnet; Supplier 1: Mouser; Supplier Part Number 1: 71-CRCW0402-34K-E3

## Sheet Power_DDRTermination.SchDoc
size 431 x 279 mm
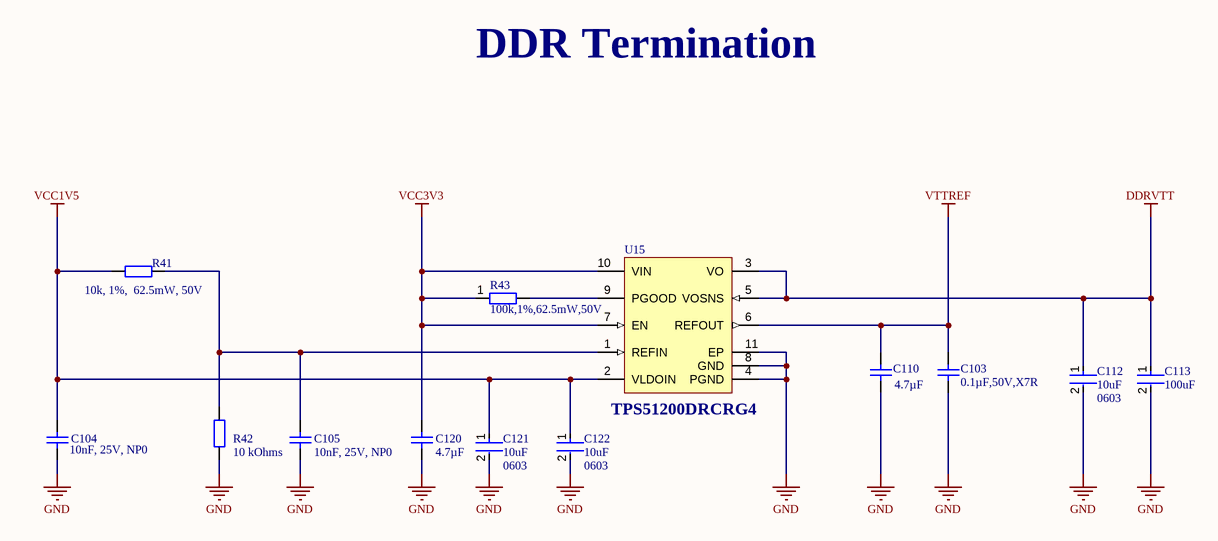
[diagram p7: Power_DDRTermination.SchDoc]

### Parts
C103  value 0.1µF,50V,X7R  [CAP0402i]  (hidden comment: 0.1µF)
C104  value 10nF, 25V, NP0  [CAP0402i]  (hidden comment: 10nF)
C105  value 10nF, 25V, NP0  [CAP0402i]  (hidden comment: 10nF)
C110  4.7µF  [CAP0402i]
C112  Capacitance: 10uF  Case/Package: 0603  [FP-GRM188-0_1-e0_2_0_55-IPC_A]  (hidden comment: GRM188R60J106ME47D)
C113  value 100uF  [FP-GRM32-0_3-MFG]  (hidden comment: GRM32ER60J107ME20L)
C120  4.7µF  [CAP0402i]
C121  Capacitance: 10uF  Case/Package: 0603  [FP-GRM188-0_1-e0_2_0_55-IPC_A]  (hidden comment: GRM188R60J106ME47D)
C122  Capacitance: 10uF  Case/Package: 0603  [FP-GRM188-0_1-e0_2_0_55-IPC_A]  (hidden comment: GRM188R60J106ME47D)
R41  value 10k, 1%,  62.5mW, 50V  [RES0402i]  (hidden comment: 10 kOhms)
R42  10 kOhms  [RES0402i]
R43  value 100k,1%,62.5mW,50V  [RES0402i]  (hidden comment: 100 kOhms)
U15  TPS51200DRCRG4  [TI-DRC10-2400X1650TP_V]

### Nets
DDRVTT: C112.1 C113.1 U15.3(VO) U15.5(VOSNS)
GND: C103.1 C104.1 C105.1 C110.1 C112.2 C113.2 C120.1 C121.2 C122.2 R42.1 U15.4(PGND) U15.8(GND) U15.11(EP)
VCC1V5: C104.2 C121.1 C122.1 R41.1 U15.2(VLDOIN)
VCC3V3: C120.2 R43.1 U15.7(EN) U15.10(VIN)
VTTREF: C103.2 C110.2 U15.6(REFOUT)
NetC105_2: C105.2 R41.2 R42.2 U15.1(REFIN)
NetR43_2: R43.2 U15.9(PGOOD)

### Notes on the sheet
- DDR Termination
- DWG. NO.
- REV.
- SHT.
- THIS DOCUMENT AND THE DATA DISCLOSED HEREIN OR HEREWITH IS THE PROPERTY OF ALTIUM LIMITED AND MAY BE FREELY DISTRIBUTED IN WHOLE. NO RIGHTS ARE RESERVED OR EXPRESS OR IMPLIED WARANTEE GIVEN.
- REVISION
- DESCRIPTION
- DATE
- APPROVED
- ENG:
- APPROVALS
- DSN:
- CHK:
- REFERENCE DOCUMENTS
- BOM:
- FAB DWG:
- PCB DWG:
- ASSY DWG:
- Date:
- SIZE
- B
- Ver:
- FILE NAME
- DWG NO.
- SHEET
- OF
- REV

### Library data of the parts
C103 = Cap_0.1uF_50V_X7R_0402: 0402, 0.1uF, 10%,  50V, X7R; Part Number: C1005X7R1H104K050BE; Manufacturer 1: TDK; Type: Ceramic; Voltage: 50V; Temperature Coefficient: X7R; Tolerance: ±10%; Operating Temperature: -55°C ~ 125°C; Mounting Type: SMT; Package: 0402 (1005 Metric); Applications: Automotive; Ratings: AEC-Q200; Supplier 1: Mouser; Supplier Part Number 1: 810-C1005X7R1H104KBE; Manufacturer Part Number 1: C1005X7R1H104K050BE; Component Type: Generic; Capacitance: 0.1µF; Note: *; Supplier 2: DigiKey; Supplier 3: Farnell; Supplier Part Number 2: 445-173610-1-ND; Supplier Part Number 3: 3416071
C104 C105 = Cap_10nF_25V_NP0_0402: 0402,10nF,5%,25V,NP0; Part Number: GRM1555C1E103JE01J; Manufacturer: Murata; Type: Ceramic; Voltage: 25V; Temperature Coefficient: NP0; Tolerance: ±5%; Operating Temperature: -55°C ~ 125°C; Mounting Type: SMT; Package: 0402 (1005 Metric); Supplier 1: Mouser; Supplier Part Number 1: 81-GRM1555C1E103JE1J; Manufacturer Part Number 1: GRM1555C1E103JE01J; Component Type: Generic; Capacitance: 10nF; Note: *; Supplier 2: DigiKey; Supplier 3: Farnell; Supplier Part Number 2: *; Supplier Part Number 3: *
C110 C120 = Cap_4.7uF_10V_10%_0402: CAP CER 4.7UF 10V X5R 0402; Part Number: C1005X5R1A475K050BC; Manufacturer 1: TDK; Value: 4.7µF, 10V, X5R; Tolerance: 10%; Dielectric Material: Ceramic; RoHS: Yes; Lead Free: Lead Free; ComponentLink2Description: https://datasheet.ciiva.com/14895/tdkmlcccaprange-14895670.pdf?src-supplier=Digi-Key; ComponentLink2URL: https://datasheet.ciiva.com/14895/tdkmlcccaprange-14895670.pdf?src-supplier=Digi-Key; Category: Ceramic Capacitors; Capacitance: 4.7µF; Voltage Rating: 10V; Supplier 1: Mouser; Manufacturer Part Number 1: C1005X5R1A475K050BC; Stock 1: 1272492; Mount: Surface Mount; Case/Package: 0402; Case Code (Metric): 1005; Case Code (Imperial): 0402; Min Operating Temperature: -55°C; Max Operating Temperature: 85°C; Package Quantity: 10000; Packaging: Cut Tape; Voltage Rating (DC): 10V; Series: C; Dielectric: X5R; Length: 0.039inch; Width: 0.02inch; Thickness: 0.022inch; RoHS Compliant: Yes; Reach SVHC Compliant: Yes; ComponentLink1URL: https://datasheet.ciiva.com/14895/tdkmlcccaprange-14895671.pdf?src-supplier=Digi-Key; ComponentLink1Description: https://datasheet.ciiva.com/14895/tdkmlcccaprange-14895671.pdf?src-supplier=Digi-Key; ComponentLink3URL: https://datasheet.ciiva.com/14895/tdkmlcccaprange-14895672.pdf?src-supplier=Digi-Key; ComponentLink3Description: https://datasheet.ciiva.com/14895/tdkmlcccaprange-14895672.pdf?src-supplier=Digi-Key; Supplier Part Number 1: 810-C1005X5R1A475KBC; Component Type: Generic
C112 C121 C122 = CMP-2006-02792-2: Chip Multilayer Ceramic Capacitors for General Purpose, 0603, 10uF, X5R, 15%, 20%, 6.3V; Packaging: Tape and Reel; Voltage Rating (DC): 6.3V; Width: 0.031inch; Termination: SMD/SMT; Dielectric: X5R; Package Quantity: 4000; Voltage Rating: 6.3V; Min Operating Temperature: -55°C; Voltage: 6.3V; Length: 1.6mm; Thickness: 0.035inch; Lead Free: Lead Free; Depth: 0.8mm; Case Code (Imperial): 0603; Max Operating Temperature: 85°C; Material: Ceramic; Height: 0.8mm; Tolerance: 20%; Mount: Surface Mount; REACH SVHC: No SVHC; Radiation Hardening: No; Case Code (Metric): 1608
C113 = CMP-2000-05259-2: CAP CER 100UF 6.3V X5R 1210; 3DS Part Number: 220-00002; Manufacturer: Murata; Temperature Coefficient: 15%; Material: Ceramic; Tolerance: 20%; Octopart: https://octopart.com/grm32er60j107me20l-murata-197007; ComponentLink2URL: https://search.murata.co.jp/Ceramy/image/img/A01X/G101/ENG/GRM32ER60J107ME20-01.pdf; Temperature Range High: +85°C; RoHS: TRUE; Device Class L3: Ceramic Capacitors; Manufacturer Part Number: GRM32ER60J107ME20L; Device Class L2: Capacitors; Voltage: 6.3V; Package: GRM32-0.3; Voltage Rating: 6.3V; Category: Cap; Device Class L1: Passive Components; Temperature Characteristic: X5R; Automotive: No; Digikey Description: CAP CER 100UF 6.3V X5R 1210; Temperature: -55°C to +85°C; Height: 2.7mm; Ipc Land Pattern Name: CAPC320250X250; Capacitance: 100uF; Temperature Range Low: -55°C; Lead Free: Yes; ComponentLink2Description: Datasheet
R41 = Res_10k_1%_0402: 0402, 10K 1%,  62.5mW, 50V; Part Number: CR0402-FX-1002GLF; Manufacturer 1: Bourns; Temperature Coefficient: 100 PPM / C; Voltage: 50V; Tolerance: ±1%; Operating Temperature: -55°C ~ 125°C; Mounting Type: SMT; Package: 0402 (1005 Metric); Supplier 1: Mouser; Supplier Part Number 1: 652-CR0402FX-1002GLF; Manufacturer Part Number 1: CR0402-FX-1002GLF; Component Type: Generic; Resistance: 10 kOhms; Note: *; Supplier 2: DigiKey; Supplier 3: Farnell; Supplier Part Number 2: CR0402-FX-1002GLFCT-ND; Supplier Part Number 3: 2333566
R42 = Res_10k_1%_0402: 0402, 10K 1%,  62.5mW, 50V; Part Number: CR0402-FX-1002GLF; Manufacturer 1: Bourns; Temperature Coefficient: 100 PPM / C; Value: 10k, 1%,  62.5mW, 50V; Voltage: 50V; Tolerance: ±1%; Operating Temperature: -55°C ~ 125°C; Mounting Type: SMT; Package: 0402 (1005 Metric); Supplier 1: Mouser; Supplier Part Number 1: 652-CR0402FX-1002GLF; Manufacturer Part Number 1: CR0402-FX-1002GLF; Component Type: Generic; Resistance: 10 kOhms; Note: *; Supplier 2: DigiKey; Supplier 3: Farnell; Supplier Part Number 2: CR0402-FX-1002GLFCT-ND; Supplier Part Number 3: 2333566
R43 = Res_100K_1%_0402: 0402, 100k, 1%, 62.5mW, 50V; Part Number: CR0402-FX-1003GLF; Manufacturer 1: Bourns; Temperature Coefficient: 100 PPM / C; Voltage: 50 V; Tolerance: ±1%; Operating Temperature: -55°C ~ 125°C; Mounting Type: SMT; Package: 0402 (1005 Metric); Supplier 1: Mouser; Supplier Part Number 1: 652-CR0402FX-1003GLF; Manufacturer Part Number 1: CR0402-FX-1003GLF; Component Type: Generic; Resistance: 100 kOhms; Note: *; Supplier 2: DigiKey; Supplier 3: Farnell; Supplier Part Number 2: CR0402-FX-1003GLFCT-ND; Supplier Part Number 3: 2787798
U15 = CMP-0395-00657-1: Single Output LDO, 3 A, 2.375 to 3.5 V Input, with DDR Termination, 10-pin SON (DRC), -40 to 85 degC, Green (RoHS & no Sb/Br); Manufacturer: Texas Instruments; Iq(Typ)(mA): 0.5; Power Good: TRUE; SubFamily: Single Channel LDO; Iout(Max)(A): 3; Vin(Max)(V): 3.5; Rating: Catalog; Vin(Min)(V): 2.3; PackageVersion: 4204102-3/L; ComponentLink2Description: Datasheet; ComponentLink3URL: http://www.ti.com/litv/pdf/mpds117k; ComponentLink1Description: Manufacturer URL; PackageDescription: 10-Pin Plastic Small Outline, Body 3 x 3 mm, Pitch 0.5 mm; ComponentLink1URL: http://www.ti.com/; ComponentLink4URL: Samples URL:http://www.ti.com/product/tps51200#samples; PackageReference: DRC10-2400X1650TP; ComponentLink4Description: URL Link1; ComponentLink3Description: Package Specification; DatasheetVersion: SLUS812; Eco-Plan: Green (RoHS & no Sb/Br); PartNumber: TPS51200DRCRG4; ComponentLink2URL: http://www.ti.com/general/docs/lit/getliterature.tsp?genericPartNumber=TPS51200&fileType=pdf; Mounting Technology: Surface Mount

## Sheet SDCARD.SchDoc
size 431 x 279 mm
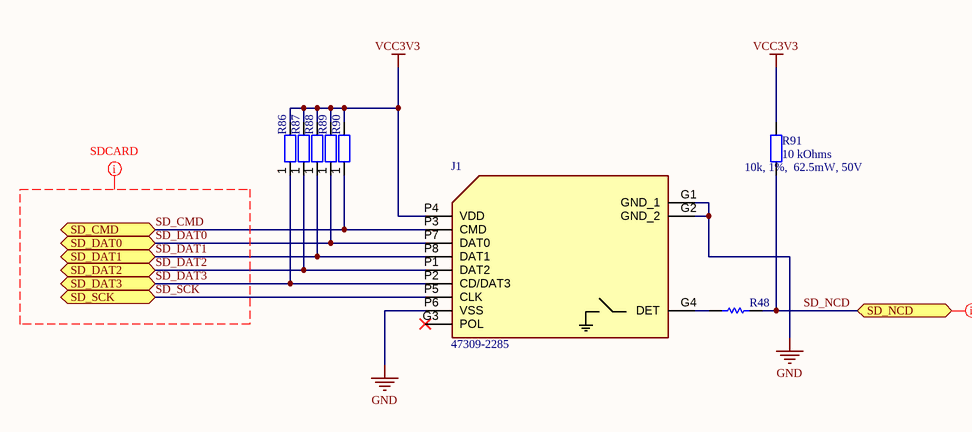
[diagram p8: SDCARD.SchDoc]

### Parts
J1  47309-2285  [473092285]
R48  ERJ2RKF33R0X  [RESC1005X40X25LL05T05]  (value not drawn)
R86  100 kOhms  [RES0402i]  (value not drawn)
R87  100 kOhms  [RES0402i]  (value not drawn)
R88  100 kOhms  [RES0402i]  (value not drawn)
R89  100 kOhms  [RES0402i]  (value not drawn)
R90  100 kOhms  [RES0402i]  (value not drawn)
R91  10 kOhms  value 10k, 1%,  62.5mW, 50V  [RES0402i]

### Ports
SD_CMD (bidir), SD_DAT0 (bidir), SD_DAT1 (bidir), SD_DAT2 (bidir), SD_DAT3 (bidir), SD_NCD (bidir), SD_SCK (bidir)

### Nets
GND: J1.G1(GND_1) J1.G2(GND_2) J1.P6(VSS)
VCC3V3: J1.P4(VDD) R86.2 R87.2 R88.2 R89.2 R90.2 R91.2
SD_CMD: J1.P3(CMD) R90.1 ; port SD_CMD
SD_DAT0: J1.P7(DAT0) R89.1 ; port SD_DAT0
SD_DAT1: J1.P8(DAT1) R88.1 ; port SD_DAT1
SD_DAT2: J1.P1(DAT2) R87.1 ; port SD_DAT2
SD_DAT3: J1.P2(CD/DAT3) R86.1 ; port SD_DAT3
SD_NCD: R48.2 R91.1 ; port SD_NCD
SD_SCK: J1.P5(CLK) ; port SD_SCK
NetJ1_G4: J1.G4(DET) R48.1

Not connected (* = marked no-connect by the designer): J1 G3(POL)*

### Layout directives
net class SD-CARD: SD_CMD, SD_DAT0, SD_DAT1, SD_DAT2, SD_DAT3, SD_NCD, SD_SCK

### Notes on the sheet
- DWG. NO.
- REV.
- SHT.
- THIS DOCUMENT AND THE DATA DISCLOSED HEREIN OR HEREWITH IS THE PROPERTY OF ALTIUM LIMITED AND MAY BE FREELY DISTRIBUTED IN WHOLE. NO RIGHTS ARE RESERVED OR EXPRESS OR IMPLIED WARANTEE GIVEN.
- REVISION
- DESCRIPTION
- DATE
- APPROVED
- ENG:
- APPROVALS
- PROJECT
- DSN:
- CHK:
- REFERENCE DOCUMENTS
- PROJECT REVISION:
- TITLE
- DOCUMENT REVISION:
- DESIGN ITEM:
- BOM:
- FAB DWG:
- PCB DWG:
- ASSY DWG:
- SCALE:
- SIZE
- B
- CAGE CODE
- FILE NAME
- DWG NO.
- SHEET
- OF
- REV

### Library data of the parts
J1 = 47309-2285: 1.10mm Pitch microSD Card Header with Detect Pin Height 2.85mm Lead-Free Gold (Au) Plated 0.762; Manufacturer_Name: Molex; Datasheet Link: https://www.molex.com/pdm_docs/sd/473092285_sd.pdf; Height: 2.85mm; Manufacturer_Part_Number: 47309-2285; Mouser Part Number: 538-47309-2285; Mouser Price/Stock: https://www.mouser.co.uk/ProductDetail/Molex/47309-2285?qs=yd8XiKYcH9k6mrof3cUHRA%3D%3D; Supplier 1: Mouser; Manufacturer: Molex; Manufacturer Part Number: 47309-2285; RoHS: Yes; Category: Memory Connectors; Stock 1: 8870; Pricing 1: 1=2.29, 10=1.83, 50=1.83, 100=1.64, 1000=1.64, 10000=1.12 (USD); Supplier Part Number 1: 538-47309-2285
R48 = CMP-2002-01146-1: Manufacturer: Panasonic; Part Number: ERJ2RKF33R0X
R86-R90 = Res_100K_1%_0402: as R43 on sheet Power_DDRTermination; Package: 0402 (1005 Metric); Voltage: 50 V; Tolerance: ±1%; Operating Temperature: -55°C ~ 125°C; Mounting Type: SMT; Supplier 1: Mouser; Supplier Part Number 1: 652-CR0402FX-1003GLF; Manufacturer Part Number 1: CR0402-FX-1003GLF; Component Type: Generic; Resistance: 100 kOhms; Note: *; Supplier 2: DigiKey; Supplier 3: Farnell; Supplier Part Number 2: CR0402-FX-1003GLFCT-ND; Supplier Part Number 3: 2787798; Value: 100k,1%,62.5mW,50V
R91 = Res_10k_1%_0402: as R41 on sheet Power_DDRTermination; Package: 0402 (1005 Metric); Voltage: 50V; Tolerance: ±1%; Operating Temperature: -55°C ~ 125°C; Mounting Type: SMT; Supplier 1: Mouser; Supplier Part Number 1: 652-CR0402FX-1002GLF; Manufacturer Part Number 1: CR0402-FX-1002GLF; Component Type: Generic; Resistance: 10 kOhms; Note: *; Supplier 2: DigiKey; Supplier 3: Farnell; Supplier Part Number 2: CR0402-FX-1002GLFCT-ND; Supplier Part Number 3: 2333566